# Altium schematic sheet RP_ComputeModule3_rev.3.0_POWER.SchDoc
size A4 portrait
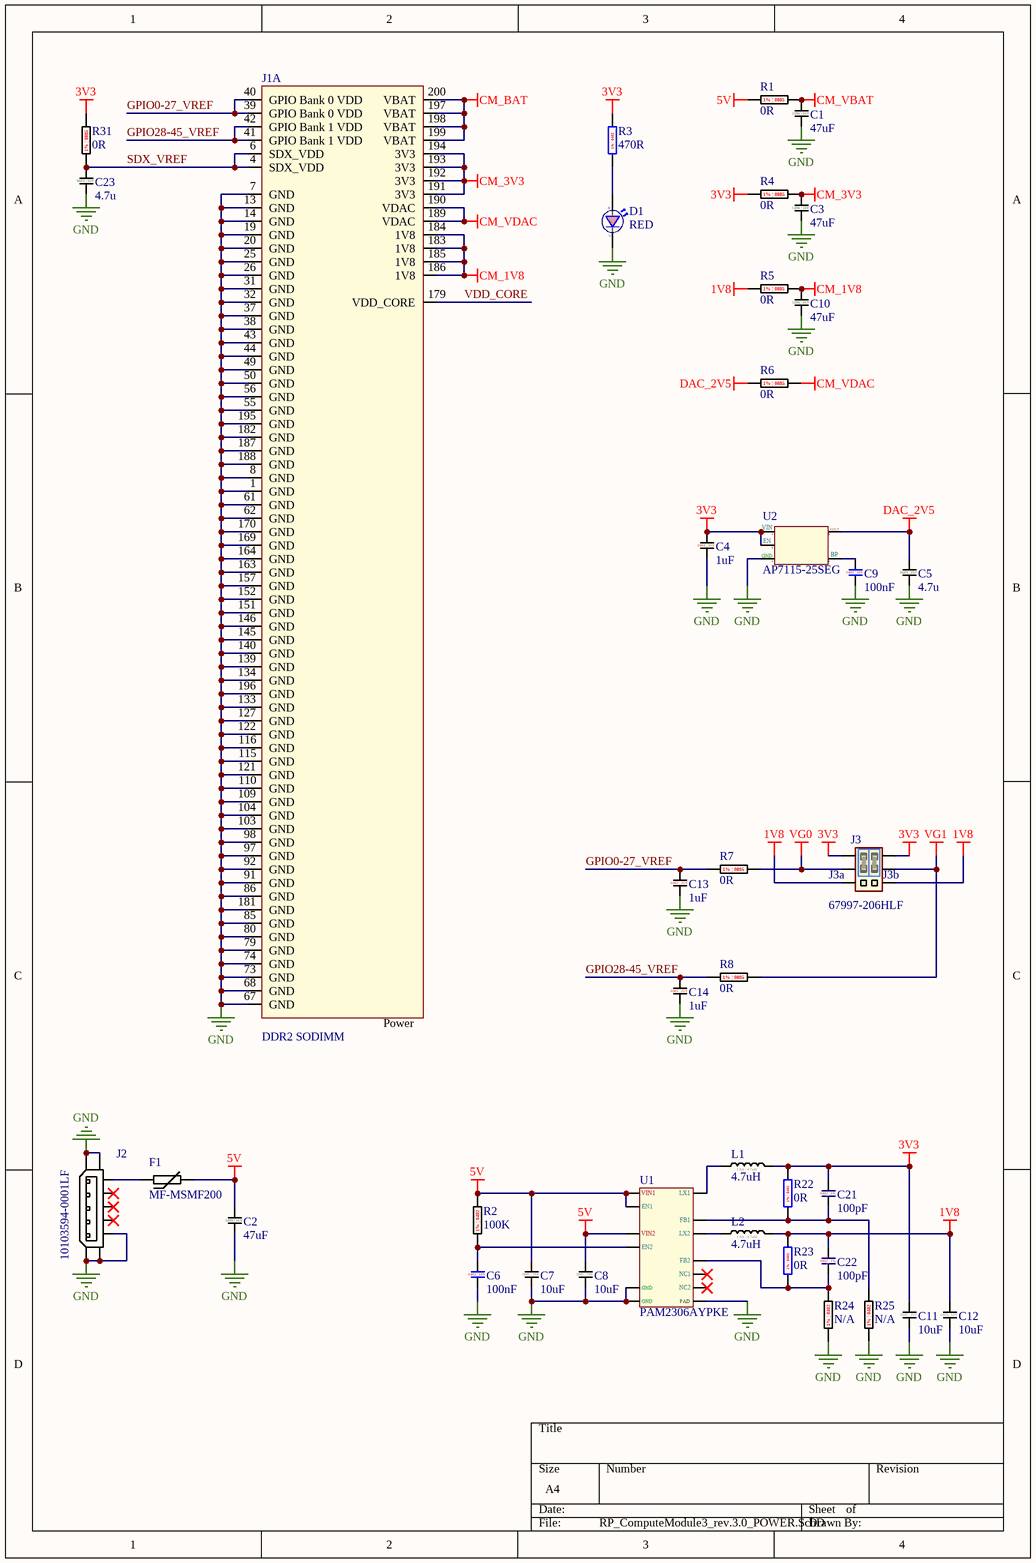
[diagram p0: RP_ComputeModule3_rev.3.0_POWER.SchDoc]

## Parts
C1  47uF  [MURATA C1206 / CAPC3216X94N]
C2  47uF  [MURATA C1206 / CAPC3216X94N]
C3  47uF  [MURATA C1206 / CAPC3216X94N]
C4  1uF  [TDK 0402 C]
C5  4.7u  [0603 Murata]
C6  100nF  [GJM 0402 C]
C7  10uF  [0805 CGA Series]
C8  10uF  [0805 CGA Series]
C9  100nF  [GJM 0402 C]
C10  47uF  [MURATA C1206 / CAPC3216X94N]
C11  10uF  [0805 CGA Series]
C12  10uF  [0805 CGA Series]
C13  1uF  [TDK 0402 C]
C14  1uF  [TDK 0402 C]
C21  100pF  [Cap0402 MIN Vishay N/A]  (no BOM)
C22  100pF  [Cap0402 MIN Vishay N/A]  (no BOM)
C23  4.7u  [0603 Murata]
D1  RED  [ROHM 0603 LED]
F1  MF-MSMF200  [Bourns MF-MSMF (Style1)]
J1  DDR2 SODIMM  [TE 1473005-4 (DDR2 SO-DIMM)]  (part A of 14)
J2  10103594-0001LF  [FCI_10103594-0001LF]
J3  67997-206HLF  [Amphenol 2x6 PINS 67997-206HLF]
J3a  Jumper  [Kobiconn 151-8011-E (Blue)]  (value not drawn)
J3b  Jumper  [Kobiconn 151-8011-E (Blue)]  (value not drawn)
L1  4.7uH  [Bourns SRN4018]
L2  4.7uH  [Bourns SRN4018]
R1  0R  [YAGEO RES0402]
R2  100K  [RES0402]
R3  470R  [Vishay RES0402]
R4  0R  [YAGEO RES0402]
R5  0R  [YAGEO RES0402]
R6  0R  [YAGEO RES0402]
R7  0R  [YAGEO RES0402]
R8  0R  [YAGEO RES0402]
R22  0R  [Vishay Beyschlag MCS0402]
R23  0R  [Vishay Beyschlag MCS0402]
R24  N/A  [RES0402N/A]  (no BOM)
R25  N/A  [RES0402N/A]  (no BOM)
R31  0R  [YAGEO RES0402]
U1  PAM2306AYPKE  [DIODES_SON45P300X300X80-13N]
U2  AP7115-25SEG  [Diodes_SOT353_SC70-5_SOT65P210X110-5N]

## Nets
1V8: C12.1 C22.2 J3.5 J3.6 L2.2 R5.2 R23.1
3V3: C4.1 C11.1 C21.2 J3.1 J3.2 L1.2 R3.1 R4.2 R22.1 R31.1 U2.1 U2.3
5V: C2.2 C7.1 C8.1 F1.2 R1.2 R2.1 U1.1 U1.6 U1.7
CM_1V8: C10.2 J1.183(1V8) J1.184(1V8) J1.185(1V8) J1.186(1V8) R5.1
CM_3V3: C3.2 J1.191(3V3) J1.192(3V3) J1.193(3V3) J1.194(3V3) R4.1
CM_BAT: J1.197(VBAT) J1.198(VBAT) J1.199(VBAT) J1.200(VBAT)
CM_VBAT: C1.2 R1.1
CM_VDAC: J1.189(VDAC) J1.190(VDAC) R6.1
DAC_2V5: C5.2 R6.2 U2.5
GND: C1.1 C2.1 C3.1 C4.2 C5.1 C6.1 C7.2 C8.2 C9.1 C10.1 C11.2 C12.2 C13.2 C14.2 C23.1 D1.C J1.1(GND) J1.7(GND) J1.8(GND) J1.13(GND) J1.14(GND) J1.19(GND) J1.20(GND) J1.25(GND) J1.26(GND) J1.31(GND) J1.32(GND) J1.37(GND) J1.38(GND) J1.43(GND) J1.44(GND) J1.49(GND) J1.50(GND) J1.55(GND) J1.56(GND) J1.61(GND) J1.62(GND) J1.67(GND) J1.68(GND) J1.73(GND) J1.74(GND) J1.79(GND) J1.80(GND) J1.85(GND) J1.86(GND) J1.91(GND) J1.92(GND) J1.97(GND) J1.98(GND) J1.103(GND) J1.104(GND) J1.109(GND) J1.110(GND) J1.115(GND) J1.116(GND) J1.121(GND) J1.122(GND) J1.127(GND) J1.133(GND) J1.134(GND) J1.139(GND) J1.140(GND) J1.145(GND) J1.146(GND) J1.151(GND) J1.152(GND) J1.157(GND) J1.163(GND) J1.164(GND) J1.169(GND) J1.170(GND) J1.181(GND) J1.182(GND) J1.187(GND) J1.188(GND) J1.195(GND) J1.196(GND) J2.5 J2.6 J2.7 J2.8 J2.9 J2.10 J2.11 R24.2 R25.2 U1.3 U1.9 U1.13 U2.2
VG0: J3.3 R7.1
VG1: J3.4 R8.1
GPIO0-27_VREF: C13.1 J1.39(GPIO_Bank_0_VDD) J1.40(GPIO_Bank_0_VDD) R7.2
GPIO28-45_VREF: C14.1 J1.41(GPIO_Bank_1_VDD) J1.42(GPIO_Bank_1_VDD) R8.2
SDX_VREF: C23.2 J1.4(SDX_VDD) J1.6(SDX_VDD) R31.2
VDD_CORE: J1.179(VDD_CORE)
NetC6_2: C6.2 R2.2 U1.12
NetC9_2: C9.2 U2.4
NetC21_1: C21.1 R22.2 R25.1 U1.4
NetC22_1: C22.1 R23.2 R24.1 U1.10
NetD1_A: D1.A R3.2
NetF1_1: F1.1 J2.1
NetL1_1: L1.1 U1.8
NetL2_1: L2.1 U1.2

Not connected (* = marked no-connect by the designer): J2 2* 3* 4*; U1 5* 11*

## Notes on the sheet
- (in symbol AC0805FR-070RL) 1% | 0805
- (in symbol AP7115-25SEG-7) VIN; VOUT; EN; BP; GND
- (in symbol C1005X5R1E105K050BC) 0402 | 25V
- (in symbol C2012X7S1C106K125AC) 0805 | 16V
- (in symbol C3216JB1C476M160AB) 1206 | 16V
- (in symbol GRM155R71A104JA01D) 0402 | 10V
- (in symbol GRT188R6YA475KE13D) 0603 | 35V
- (in symbol MCS04020C4700FE000) 1% | 0402
- (in symbol MCS04020Z0000ZE000) 1% | 0402
- (in symbol PAM2306AYPKE) VIN1; LX1; EN1; FB1; VIN2; LX2; EN2; FB2; NC1; GND; NC2; PAD
- (in symbol Resistor_N/A) 1% | 0402
- (in symbol SG73P1ETTP1003F) 1% | 0402
- (in symbol SRN4018-4R7M) 1.9A / 4.7uH
- (in symbol VJ0402A101FXACW1BC_NA) 0402 | 1%

## Library data of the parts
C1-C3 C10 = C3216JB1C476M160AB: 47µF ±20% 16V JB Ceramic Capacitor -25°C ~ 85°C Surface Mount, MLCC 1206 (3216 Metric) 0.126" L x 0.063" W (3.20mm x 1.60mm); Manufacturer: TDK; Supplier 1: Digi-Key; Manufacturer Part Number: C3216JB1C476M160AB; Stock 1: 203837; Pricing 1: 1=1.2, 10=0.949, 100=0.7116, 500=0.53762, 1000=0.47438 (USD); Mount: Surface Mount; Case/Package: 1206; Case Code (Metric): 3216; Case Code (Imperial): 1206; Dielectric Material: Ceramic; Min Operating Temperature: -25°C; Max Operating Temperature: 85°C; Package Quantity: 1; Packaging: Tape and Reel; Capacitance: 47uF; Tolerance: 20%; Voltage Rating: 16V; Termination: SMD/SMT; Composition: Ceramic; Voltage Rating (DC): 16V; Length: 0.126inch; Height: 1.6mm; Width: 0.063inch; Thickness: 0.069inch; Lead Free: Lead Free; ComponentLink1URL: https://product.tdk.com/en/products/common/pdf/mlcc_partnumber_description.pdf; ComponentLink1Description: https://product.tdk.com/en/products/common/pdf/mlcc_partnumber_description.pdf; ComponentLink2URL: http://product.tdk.com/en/catalog/datasheets/mlcc_commercial_general_en.pdf; ComponentLink2Description: http://product.tdk.com/en/catalog/datasheets/mlcc_commercial_general_en.pdf; ComponentLink3URL: http://www.mouser.com/ds/2/400/lcc_commercial_general_en-837201.pdf; ComponentLink3Description: http://www.mouser.com/ds/2/400/lcc_commercial_general_en-837201.pdf
C4 C13 C14 = C1005X5R1E105K050BC: Multilayer Ceramic Capacitors MLCC - SMD/SMT 0402 25V 1uF X5R 10% T: 0.5mm; Manufacturer: TDK; Type: Multilayer Ceramic Chip Capacitor; Voltage Rating DC: 25 VDC; Capacitance - nF: 1000 nF; Product Status: Not Recommended for New Designs; Supplier 1: Mouser; Manufacturer Part Number: C1005X5R1E105K050BC; RoHS: RoHS Compliant; Category: Multilayer Ceramic Capacitors MLCC - SMD/SMT; Stock 1: 6906; Pricing 1: 1=0.201, 10=0.136, 100=0.054, 500=0.045, 1000=0.037, 2500=0.031, 10000=0.027 (USD); Capacitance: 1 uF; Height: 0.5 mm; Length: 1 mm; Package / Case: 0402 (1005 metric); Packaging: Cut Tape; Product: General Type MLCCs; Series: C; Termination Style: SMD/SMT; Tolerance: 10 %; Width: 0.5 mm; Brand: TDK; Case Code - in: 0402; Case Code - mm: 1005; Dielectric: X5R; Maximum Operating Temperature: + 85 C; Minimum Operating Temperature: - 55 C; Standard Pack Qty: 10000; RoHS - Mouser: Y; Minimum Order Quantity: 1; Reeling: True; ComponentLink1URL: https://www.mouser.com/ds/2/400/lcc_commercial_general_en-837201.pdf; ComponentLink1Description: https://www.mouser.com/ds/2/400/lcc_commercial_general_en-837201.pdf
C5 C23 = GRT188R6YA475KE13D: 4.7µF 35V Ceramic Capacitor X5R 0603 (1608 Metric) 0.063" L x 0.031" W (1.60mm x 0.80mm); Manufacturer: Murata; Capacitance: 4.7uF; Tolerance: 10%; Supplier 1: Mouser; Manufacturer Part Number: GRT188R6YA475KE13D; Stock 1: 292; Pricing 1: 10000=0.133 (USD); Mount: Surface Mount; Case/Package: 0603; Case Code (Metric): 1608; Case Code (Imperial): 0603; Min Operating Temperature: -55°C; Max Operating Temperature: 85°C; Packaging: Tape and Reel; Voltage Rating: 35V; Length: 0.063inch; Width: 0.031inch; Thickness: 0.035inch; ComponentLink1URL: http://search.murata.co.jp/Ceramy/image/img/A01X/G101/ENG/GRT188R6YA475KE13-01.pdf; ComponentLink1Description: http://search.murata.co.jp/Ceramy/image/img/A01X/G101/ENG/GRT188R6YA475KE13-01.pdf
C6 C9 = GRM155R71A104JA01D: Multilayer Ceramic Capacitors MLCC - SMD/SMT 0402 0.1uF 10volts 5%; Manufacturer: Murata Electronics; Type: Chip Monolithic Ceramic Capacitor; Voltage Rating DC: 10 VDC; Capacitance - pF: 100000 pF; Dielectric: X7R; Supplier 1: Mouser; Manufacturer Part Number: GRM155R71A104JA01D; RoHS: RoHS Compliant; Category: Multilayer Ceramic Capacitors MLCC - SMD/SMT; Stock 1: 376; Pricing 1: 1=0.100, 10=0.024, 100=0.011, 500=0.008, 1000=0.006, 5000=0.005, 10000=0.004 (USD); Capacitance: 0.1 uF; Height: 0.5 mm; Length: 1 mm; Package / Case: 0402 (1005 metric); Packaging: Cut Tape; Product: General Type MLCCs; Series: GRM; Termination Style: SMD/SMT; Tolerance: 5 %; Width: 0.5 mm; Brand: Murata Electronics; Capacitance - nF: 100 nF; Case Code - in: 0402; Case Code - mm: 1005; Maximum Operating Temperature: + 125 C; Minimum Operating Temperature: - 55 C; Standard Pack Qty: 10000; RoHS - Mouser: Y; Minimum Order Quantity: 1; Reeling: True; ComponentLink1URL: https://www.mouser.com/ds/2/281/c02e-2905.pdf; ComponentLink1Description: https://www.mouser.com/ds/2/281/c02e-2905.pdf
C7 C8 C11 C12 = C2012X7S1C106K125AC: Manufacturer: TDK; Supplier 1: Mouser; Manufacturer Part Number: C2012X7S1C106K125AC; Stock 1: 5410; Pricing 1: 1=0.7, 10=0.4, 50=0.4, 100=0.27, 1000=0.226, 10000=0.138 (USD)
C21 C22 = VJ0402A101FXACW1BC_NA: Multilayer Ceramic Capacitors MLCC - SMD/SMT 0402 100pF 50volts C0G 1%; Manufacturer: Vishay Vitramon; Dielectric Material: Tantalum; Voltage Rating (DC): 50V; Supplier 1: Mouser; Manufacturer Part Number: VJ0402A101FXACW1BC; Stock 1: 4478; Pricing 1: 10000=0.026 (USD); Mount: Surface Mount; Case/Package: 0402; Case Code (Imperial): 0402; Case Code (Metric): 1005; Min Operating Temperature: -55°C; Max Operating Temperature: 125°C; Capacitance: 100pF; Tolerance: 1%; Packaging: Tape and Reel; Package Quantity: 10000; Dielectric: C0G; Termination: SMD/SMT; Length: 1mm; Height: 0.55mm; Width: 0.5mm; Depth: 0.5mm; Lead Free: Lead Free; ComponentLink1URL: https://datasheet.ciiva.com/11477/vjw1bcbascomseries-11477228.pdf; ComponentLink1Description: https://datasheet.ciiva.com/11477/vjw1bcbascomseries-11477228.pdf
D1 = SML-D12U8WT86: LED RED DIFFUSED 0603 SMD; Manufacturer: Rohm; Lens Colour: White,Clear,Diffused; Lens Style: Diffused,Colorless,Rectangular; Forward Voltage: 2.2V; Forward Current: 20mA; Luminous Intensity: 63mcd; Dominant Wavelength: 620nm; Number of LEDs: 1; Viewing Angle: 160°; Supplier 1: Mouser; Manufacturer Part Number: SML-D12U8WT86; Stock 1: 16573; Pricing 1: 1=0.32, 10=0.216, 50=0.216, 100=0.09, 1000=0.062, 10000=0.041 (USD); Mount: Surface Mount; Case/Package: 0603; Number of Pins: 2; Colour: Red; Case Code (Metric): 1608; Case Code (Imperial): 0603; Min Operating Temperature: -40°C; Max Operating Temperature: 85°C; Packaging: Tape and Reel; Wavelength: 620nm; Package Quantity: 1; Illumination Colour: Red; Test Current: 20mA; Lens Transparency: Diffused; Length: 1.6mm; Height: 0.65mm; Width: 0.8mm; Radiation Hardening: No; REACH SVHC: No SVHC; Lead Free: Lead Free; ComponentLink1URL: https://datasheet.ciiva.com/11774/0900766b80df3ada-11774020.pdf; ComponentLink1Description: https://datasheet.ciiva.com/11774/0900766b80df3ada-11774020.pdf; ComponentLink2URL: https://datasheet.ciiva.com/2110/sml-d1-2110375.pdf; ComponentLink2Description: https://datasheet.ciiva.com/2110/sml-d1-2110375.pdf; ComponentLink3URL: https://datasheet.ciiva.com/2110/sml-d1-2110376.pdf; ComponentLink3Description: https://datasheet.ciiva.com/2110/sml-d1-2110376.pdf; ComponentLink4URL: https://datasheet.ciiva.com/2110/sml-d1-2110377.pdf; ComponentLink4Description: https://datasheet.ciiva.com/2110/sml-d1-2110377.pdf; ComponentLink5URL: https://datasheet.ciiva.com/9324/sml-d1-9324826.pdf; ComponentLink5Description: https://datasheet.ciiva.com/9324/sml-d1-9324826.pdf; ComponentLink6URL: https://datasheet.ciiva.com/17420/sml-d1-17420939.pdf; ComponentLink6Description: https://datasheet.ciiva.com/17420/sml-d1-17420939.pdf
F1 = MF-MSMF200-2: PTC RESETTABLE 2.00A 8V 1812; Manufacturer: Bourns; Max Current Rating: 40A; Power Dissipation: 800mW; Hold Current: 2A; Trip Current: 4A; Resistance: 80mR; Time to Trip: 3s; Approvals: UL,CSA,TUV; Supplier 1: Mouser; Manufacturer Part Number: MF-MSMF200-2; Stock 1: 5483; Pricing 1: 1=0.38, 10=0.306, 50=0.306, 100=0.255, 1000=0.244, 10000=0.244 (USD); Mount: Surface Mount,PCB; Case/Package: 1812; Case Code (Metric): 4532; Case Code (Imperial): 1812; Number of Terminals: 2; Terminal Material: Nickel; Min Operating Temperature: -40°C; Max Operating Temperature: 85°C; Current Rating: 40A; Package Quantity: 2000; Packaging: Tape and Reel; Operating Supply Voltage: 8V; Voltage Rating: 8V; Termination: SMD/SMT; Max Power Dissipation: 800mW; Voltage Rating (DC): 8V; Length: 4.73mm; Height: 0.85mm; Width: 3.41mm; Radiation Hardening: No; REACH SVHC: No SVHC; Lead Free: Lead Free; ComponentLink1URL: https://datasheet.ciiva.com/1228/1786007-1228163.pdf; ComponentLink1Description: https://datasheet.ciiva.com/1228/1786007-1228163.pdf; ComponentLink2URL: https://datasheet.ciiva.com/3020/mfmsmf-3020419.pdf; ComponentLink2Description: https://datasheet.ciiva.com/3020/mfmsmf-3020419.pdf; ComponentLink3URL: https://datasheet.ciiva.com/326/mfmsmf-326966.pdf; ComponentLink3Description: https://datasheet.ciiva.com/326/mfmsmf-326966.pdf; ComponentLink4URL: https://datasheet.ciiva.com/326/mfmsmf-326967.pdf; ComponentLink4Description: https://datasheet.ciiva.com/326/mfmsmf-326967.pdf; ComponentLink5URL: https://datasheet.ciiva.com/326/mfmsmf-326968.pdf; ComponentLink5Description: https://datasheet.ciiva.com/326/mfmsmf-326968.pdf; ComponentLink6URL: https://datasheet.ciiva.com/16692/mfmsmf-16692201.pdf; ComponentLink6Description: https://datasheet.ciiva.com/16692/mfmsmf-16692201.pdf; ComponentLink7URL: https://datasheet.ciiva.com/3019/mfmsmf-3019786.pdf; ComponentLink7Description: https://datasheet.ciiva.com/3019/mfmsmf-3019786.pdf; ComponentLink8URL: https://datasheet.ciiva.com/28411/1786007-28411578.pdf; ComponentLink8Description: https://datasheet.ciiva.com/28411/1786007-28411578.pdf; ComponentLink9URL: https://datasheet.ciiva.com/1274/1786007-1274556.pdf; ComponentLink9Description: https://datasheet.ciiva.com/1274/1786007-1274556.pdf; ComponentLink10URL: https://datasheet.ciiva.com/15187/getdatasheetpartid-117210-15187148.pdf; ComponentLink10Description: https://datasheet.ciiva.com/15187/getdatasheetpartid-117210-15187148.pdf; ComponentLink11URL: https://datasheet.ciiva.com/1274/1786007-1274557.pdf; ComponentLink11Description: https://datasheet.ciiva.com/1274/1786007-1274557.pdf; ComponentLink12URL: https://datasheet.ciiva.com/30196/575mfmsmf-30196429.pdf; ComponentLink12Description: https://datasheet.ciiva.com/30196/575mfmsmf-30196429.pdf
J1 = 1473005-4: TE CONNECTIVITY / AMP         1473005-4             SOCKET IC, DIMM, DDR2, 1.8V, 200WAY; Number of Contacts: 200; Memory Type: SDRAM,DDR; Insulation Resistance: 250MR; PCB Mount Retention: With; Gender: Female; Contact Current Rating: 500mA; Circuit Application: Power; Connector System: Cable-to-Board; Sealable: No (Without); Pitch: 0.6mm; Row Spacing: 0.244inch; Stack Height: 5.2mm; Supplier 1: Digi-Key; Manufacturer: TE Connectivity; Manufacturer Part Number: 1473005-4; Stock 1: 3804; Pricing 1: 1=3.9, 10=3.744, 25=3.432, 50=3.276, 100=3.12, 250=2.73, 500=2.652, 1000=2.262, 2500=2.106 (USD); Mount: Surface Mount; Number of Pins: 200; Contact Material: Copper Alloy; Contact Plating: Gold; Housing Colour: Black; Housing Material: Thermoplastic; Insulation Material: Thermoplastic; Min Operating Temperature: -67°C; Max Operating Temperature: 185°C; Number of Rows: 2; Orientation: Right Angle; Termination: Solder; Packaging: Tray; Package Quantity: 20; Number of Positions: 200; Voltage Rating: 1.8V; Connector Type: Socket; Length: 71.5mm; Depth: 26mm; Radiation Hardening: No; ELV: Compliant; Flammability Rating: UL94 V-0; Lead Free: Lead Free; REACH SVHC: No SVHC; ComponentLink1URL: https://datasheet.ciiva.com/682/eng-cd-1473005-j2-682720.pdf; ComponentLink1Description: https://datasheet.ciiva.com/682/eng-cd-1473005-j2-682720.pdf; ComponentLink2URL: https://datasheet.ciiva.com/15171/getdatasheetpartid-99150-15171488.pdf; ComponentLink2Description: https://datasheet.ciiva.com/15171/getdatasheetpartid-99150-15171488.pdf; ComponentLink3URL: https://datasheet.ciiva.com/1105/582309-1105221.pdf; ComponentLink3Description: https://datasheet.ciiva.com/1105/582309-1105221.pdf; ComponentLink4URL: https://datasheet.ciiva.com/682/eng-cd-1473005-j2-682726.pdf; ComponentLink4Description: https://datasheet.ciiva.com/682/eng-cd-1473005-j2-682726.pdf; ComponentLink5URL: https://datasheet.ciiva.com/14156/04821302-14156311.pdf; ComponentLink5Description: https://datasheet.ciiva.com/14156/04821302-14156311.pdf; ComponentLink6URL: https://datasheet.ciiva.com/3136/eng-cd-1473005-j-3136060.pdf; ComponentLink6Description: https://datasheet.ciiva.com/3136/eng-cd-1473005-j-3136060.pdf; ComponentLink7URL: https://datasheet.ciiva.com/16380/eng-cd-1473005-j-16380909.pdf; ComponentLink7Description: https://datasheet.ciiva.com/16380/eng-cd-1473005-j-16380909.pdf; ComponentLink8URL: https://datasheet.ciiva.com/16651/eng-cd-1473005-j-16651646.pdf; ComponentLink8Description: https://datasheet.ciiva.com/16651/eng-cd-1473005-j-16651646.pdf
J2 = 10103594-0001LF: USB - micro B USB 2.0 Receptacle Connector 5 Position Surface Mount, Right Angle, Horizontal; Manufacturer: Amphenol FCI; Voltage Rating: 100V; Current Rating: 1.8A; Connector Type: USB,Receptacle; Number of Ports: 1; Insulation Resistance: 1GR; Number of Contacts: 5; USB Standard: USB 2.0; Pitch: 0.65mm; Supplier 1: Mouser; Manufacturer Part Number: 10103594-0001LF; Stock 1: 28662; Pricing 1: 1=0.7, 10=0.522, 50=0.522, 100=0.501, 1000=0.359, 10000=0.294 (USD); Mount: Surface Mount,Horizontal; Contact Plating: Nickel,Gold; Contact Material: Copper,Copper Alloy; Number of Terminals: 5; Housing Material: Thermoplastic; Min Operating Temperature: -55°C; Max Operating Temperature: 85°C; Termination: Solder; Orientation: Right Angle; Gender: Receptacle; Packaging: Tape and Reel; Package Quantity: 1500; Max Voltage Rating (AC): 100V; Length: 8.04mm; Radiation Hardening: No; REACH SVHC: No SVHC; Lead Free: Lead Free; ComponentLink1URL: https://datasheet.ciiva.com/8015/10103594-8015248.pdf; ComponentLink1Description: https://datasheet.ciiva.com/8015/10103594-8015248.pdf; ComponentLink2URL: https://datasheet.ciiva.com/11731/0900766b80ed1ae4-11731328.pdf; ComponentLink2Description: https://datasheet.ciiva.com/11731/0900766b80ed1ae4-11731328.pdf; ComponentLink3URL: https://datasheet.ciiva.com/14618/70236822-14618885.pdf; ComponentLink3Description: https://datasheet.ciiva.com/14618/70236822-14618885.pdf; ComponentLink4URL: https://datasheet.ciiva.com/22654/1469075-22654519.pdf; ComponentLink4Description: https://datasheet.ciiva.com/22654/1469075-22654519.pdf; ComponentLink5URL: https://datasheet.ciiva.com/851/10103594-851115.pdf; ComponentLink5Description: https://datasheet.ciiva.com/851/10103594-851115.pdf; ComponentLink6URL: https://datasheet.ciiva.com/5726/10103594-5726971.pdf; ComponentLink6Description: https://datasheet.ciiva.com/5726/10103594-5726971.pdf; ComponentLink7URL: https://datasheet.ciiva.com/851/10103594-851116.pdf; ComponentLink7Description: https://datasheet.ciiva.com/851/10103594-851116.pdf; ComponentLink8URL: https://datasheet.ciiva.com/851/10103594-851117.pdf; ComponentLink8Description: https://datasheet.ciiva.com/851/10103594-851117.pdf
J3 = 67997-206HLF: 6 Positions Header, Unshrouded Connector 0.100" (2.54mm) Through Hole Gold or Gold, GXT™; Manufacturer: Amphenol FCI; Current Rating: 3A; Voltage Rating: 1.5kV; Number of Positions: 6; Insulation Resistance: 5GR; Gender: Male; Connector Type: Male Pin; Mating Post Length: 5.84mm; Row Spacing: 0.1inch; Supplier 1: Mouser; Manufacturer Part Number: 67997-206HLF; Stock 1: 2377; Pricing 1: 1=0.33, 10=0.223, 50=0.223, 100=0.215, 1000=0.154, 10000=0.123 (USD); Mount: Through Hole; Contact Plating: Nickel,Gold,GXT; Contact Material: Bronze; Colour: Black; Housing Colour: Black; Housing Material: Thermoplastic; Min Operating Temperature: -65°C; Max Operating Temperature: 125°C; Number of Rows: 2; Contact Gender: Male; Packaging: Bulk; Package Quantity: 100; Termination: Solder; Max Voltage Rating (AC): 1.5kV; Number of Contacts: 6; Orientation: Straight; Length: 7.62mm; Pitch: 2.54mm; Termination Post Length: 3.05mm; Contact Mating Length: 0.23inch; Depth: 4.83mm; Radiation Hardening: No; Flammability Rating: UL94 V-0; ComponentLink1URL: https://datasheet.ciiva.com/5150/67996-223474-5150000.pdf; ComponentLink1Description: https://datasheet.ciiva.com/5150/67996-223474-5150000.pdf; ComponentLink2URL: https://datasheet.ciiva.com/9474/67996-9474266.pdf; ComponentLink2Description: https://datasheet.ciiva.com/9474/67996-9474266.pdf; ComponentLink3URL: https://datasheet.ciiva.com/728/67996-728908.pdf; ComponentLink3Description: https://datasheet.ciiva.com/728/67996-728908.pdf
J3a J3b = 151-8011-E: Headers & Wire Housings MINI JUMPER GF 6.0MM CLOSE TYPE BLUE; Manufacturer: Kobiconn; Number of Positions: 2; Pitch: 2.54mm; Supplier 1: Mouser; Manufacturer Part Number: 151-8011-E; Stock 1: 0; Contact Gender: Male; Package Quantity: 2000; ComponentLink1URL: https://datasheet.ciiva.com/5162/kc-301174-5162989.pdf; ComponentLink1Description: https://datasheet.ciiva.com/5162/kc-301174-5162989.pdf
L1 L2 = SRN4018-4R7M: FIXED IND 4.7UH 1.9A 84 MOHM SMD; Manufacturer: Bourns; Core Material: Ferrite; Material: Steel; Saturation Current: 2A; Tolerance: 20%; Shielding: Shielded; DC Resistance (DCR): 84mR; Self Resonant Frequency: 35MHz; Test Frequency: 100kHz; Supplier 1: Mouser; Manufacturer Part Number: SRN4018-4R7M; Stock 1: 1984; Pricing 1: 1=0.36, 10=0.246, 50=0.246, 100=0.224, 1000=0.152, 10000=0.131 (USD); Mount: Surface Mount; Case/Package: Nonstandard; Number of Pins: 2; Min Operating Temperature: -25°C; Max Operating Temperature: 120°C; Packaging: Cut Tape; Package Quantity: 3000; Current Rating: 1.9A; Inductance: 4.7uh; Inductance Tolerance: 20%; Composition: Wirewound; Max DC Current: 1.9A; Termination: SMD/SMT; RMS Current (Irms): 1.9A; DC Current: 1.9A; Military Standard: Not; Length: 4mm; Height: 1.8mm; Width: 4mm; Height - Seated (Max): 0.071inch; Depth: 4.2mm; Radiation Hardening: No; REACH SVHC: No SVHC; ComponentLink1URL: https://datasheet.ciiva.com/6700/srn4018-6700960.pdf; ComponentLink1Description: https://datasheet.ciiva.com/6700/srn4018-6700960.pdf; ComponentLink2URL: https://datasheet.ciiva.com/22717/1684089-22717774.pdf; ComponentLink2Description: https://datasheet.ciiva.com/22717/1684089-22717774.pdf; ComponentLink3URL: https://datasheet.ciiva.com/46395/1684089-46395167.pdf; ComponentLink3Description: https://datasheet.ciiva.com/46395/1684089-46395167.pdf
R1 R4-R8 R31 = AC0805FR-070RL: Thick Film Resistors - SMD 1/8W 0.0ohm 1%; Manufacturer: Yageo; Voltage Rating: 150V; Power Rating: 125mW; Resistance: 0mR; Temperature Coefficient: 200ppm/°C; Supplier 1: Mouser; Manufacturer Part Number: AC0805FR-070RL; Stock 1: 1027; Pricing 1: 1=0.16, 10=0.036, 50=0.036, 100=0.012, 1000=0.009, 10000=0.004 (USD); Mount: Surface Mount; Case/Package: 0805; Case Code (Imperial): 0805; Case Code (Metric): 2012; Min Operating Temperature: -55°C; Max Operating Temperature: 155°C; Tolerance: 1%; Packaging: Tape and Reel; Termination: SMD/SMT; Lead Free: Lead Free; ComponentLink1URL: https://datasheet.ciiva.com/12656/pyu-ac-51-rohs-l-2-12656890.pdf; ComponentLink1Description: https://datasheet.ciiva.com/12656/pyu-ac-51-rohs-l-2-12656890.pdf
R2 = SG73P1ETTP1003F: Thick Film Resistors - SMD 0.125W 100Kohm 1% 200ppm; Manufacturer: KOA Speer; Resistance: 100kR; Power Rating: 125mW; Voltage Rating: 200V; Temperature Coefficient: 200ppm/°C; Voltage Rating (DC): 50V; Supplier 1: Mouser; Manufacturer Part Number: SG73P1ETTP1003F; Stock 1: 17094; Pricing 1: 1=0.24, 10=0.24, 50=0.053, 100=0.041, 1000=0.03, 10000=0.018 (USD); Case/Package: 0402; Case Code (Imperial): 0402; Case Code (Metric): 1005; Min Operating Temperature: -55°C; Max Operating Temperature: 155°C; Tolerance: 1%; Packaging: Tape and Reel; Termination: SMD/SMT; ComponentLink1URL: https://datasheet.ciiva.com/5567/sg73-5567782.pdf; ComponentLink1Description: https://datasheet.ciiva.com/5567/sg73-5567782.pdf
R3 = MCS04020C4700FE000: RES SMD 470 OHM 1% 1/10W 0402; Manufacturer: Vishay BCcomponents; Temperature Coefficient: 50ppm/°C; Max Power Dissipation: 100mW; Supplier 1: Digi-Key; Manufacturer Part Number: MCS04020C4700FE000; Stock 1: 98990; Pricing 1: 1=0.3, 10=0.254, 100=0.0993, 1000=0.04158, 2500=0.03812, 5000=0.03465 (USD); Case/Package: 0402; Contact Plating: Tin; Min Operating Temperature: -55°C; Max Operating Temperature: 125°C; Resistance: 470R; Tolerance: 1%; Composition: Thin Film; Packaging: Tape and Reel; Package Quantity: 10000; Number of Terminations: 2; Military Standard: Not; Length: 0.039inch; Height: 0.015inch; Width: 0.02inch; Depth: 0.5mm; Radiation Hardening: No; Lead Free: Lead Free; ComponentLink1URL: https://datasheet.ciiva.com/16892/mc-pro-16892843.pdf; ComponentLink1Description: https://datasheet.ciiva.com/16892/mc-pro-16892843.pdf; ComponentLink2URL: https://datasheet.ciiva.com/2569/mc-pro-2569740.pdf; ComponentLink2Description: https://datasheet.ciiva.com/2569/mc-pro-2569740.pdf; ComponentLink3URL: https://datasheet.ciiva.com/8901/mc-pro-8901326.pdf; ComponentLink3Description: https://datasheet.ciiva.com/8901/mc-pro-8901326.pdf
R22 R23 = MCS04020Z0000ZE000: Res Thin Film 0402 0 Ohm Molded SMD Automotive Medical Paper T/R; Manufacturer: Vishay Beyschlag; Resistance: 0mR; Power Rating: 100mW; Voltage Rating: 50V; Supplier 1: Digi-Key; Manufacturer Part Number: MCS04020Z0000ZE000; Stock 1: 192140; Pricing 1: 1=0.31, 10=0.266, 25=0.1936, 50=0.1404, 100=0.1041, 250=0.07988, 500=0.06292, 1000=0.04356, 5000=0.0363 (USD); Mount: Surface Mount; Case/Package: 0402; Contact Plating: Nickel,Tin; Case Code (Metric): 1005; Case Code (Imperial): 0402; Min Operating Temperature: -55°C; Max Operating Temperature: 125°C; Composition: Thin Film; Package Quantity: 1; Packaging: Tape and Reel; Number of Terminations: 2; Military Standard: Not; Max Power Dissipation: 100mW; Voltage Rating (DC): 50V; Termination: Wraparound; Length: 1mm; Height: 0.015inch; Width: 0.02inch; Depth: 0.5mm; Radiation Hardening: No; REACH SVHC: No SVHC; Lead Free: Lead Free; ComponentLink1URL: https://datasheet.ciiva.com/2472/mc-pro-2472006.pdf; ComponentLink1Description: https://datasheet.ciiva.com/2472/mc-pro-2472006.pdf; ComponentLink2URL: https://datasheet.ciiva.com/8901/mc-pro-8901830.pdf; ComponentLink2Description: https://datasheet.ciiva.com/8901/mc-pro-8901830.pdf; ComponentLink3URL: https://datasheet.ciiva.com/2472/mc-pro-2472007.pdf; ComponentLink3Description: https://datasheet.ciiva.com/2472/mc-pro-2472007.pdf; ComponentLink4URL: https://datasheet.ciiva.com/2472/mc-pro-2472008.pdf; ComponentLink4Description: https://datasheet.ciiva.com/2472/mc-pro-2472008.pdf
R24 R25 = Resistor_N/A
U1 = PAM2306AYPKE: Conv DC-DC Dual Step Down 2.5V 5.5V 12-Pin WDFN T/R; Manufacturer: Diodes; Number of Outputs: 2; Output Voltage: 3.3V; Max Output Current: 1A; Efficiency: 96%; Switching Frequency: 1.5MHz; Synchronous Rectifier: Yes; Operating Supply Current: 40uA; Supplier 1: Mouser; Manufacturer Part Number: PAM2306AYPKE; Stock 1: 11874; Pricing 1: 1=0.71, 10=0.589, 50=0.589, 100=0.38, 1000=0.304, 10000=0.248 (USD); Mount: Surface Mount; Number of Pins: 12; Min Operating Temperature: -40°C; Max Operating Temperature: 85°C; Packaging: Tape and Reel; Min Input Voltage: 2.5V; Max Input Voltage: 5.5V; Min Output Voltage: 3.3V; Output Current: 1A; Package Quantity: 3000; Min Supply Voltage: 2.5V; Operating Supply Voltage: 5.5V; Radiation Hardening: No; Lead Free: Lead Free; ComponentLink1URL: http://www.diodes.com/datasheets/PAM2306.pdf; ComponentLink1Description: http://www.diodes.com/datasheets/PAM2306.pdf; ComponentLink2URL: http://www.mouser.com/ds/2/115/PAM2306-336770.pdf; ComponentLink2Description: http://www.mouser.com/ds/2/115/PAM2306-336770.pdf; ComponentLink3URL: https://www.diodes.com/assets/Datasheets/PAM2306.pdf; ComponentLink3Description: https://www.diodes.com/assets/Datasheets/PAM2306.pdf
U2 = AP7115-25SEG-7: IC REG LDO 2.5V 0.15A SOT353; Manufacturer: Diodes; Max Power Dissipation: 500mW; Number of Outputs: 1; Max Input Voltage: 5.5V; Max Output Current: 150mA; Quiescent Current: 80uA; Polarity: Positive; Accuracy: 2%; Dropout Voltage: 200mV; Min Current Limit: 200mA; Power Supply Rejection Ratio (PSRR): 70dB; Supplier 1: Mouser; Manufacturer Part Number: AP7115-25SEG-7; Stock 1: 5001; Pricing 1: 1=0.38, 10=0.288, 50=0.288, 100=0.156, 1000=0.117, 10000=0.095 (USD); Mount: Surface Mount; Case/Package: SOT-353-5; Number of Pins: 5; Contact Plating: Tin,Matte; Min Operating Temperature: -40°C; Max Operating Temperature: 85°C; Output Voltage: 2.5V; Packaging: Tape and Reel; Min Input Voltage: 2.5V; Package Quantity: 1; Output Current: 150mA; Number of Regulators: 1; Power Rating: 500mW; Input Bias Current: 80uA; Length: 3mm; Height: 1.1mm; Width: 1.6mm; ComponentLink1URL: https://datasheet.ciiva.com/2039/ap7115-2039392.pdf; ComponentLink1Description: https://datasheet.ciiva.com/2039/ap7115-2039392.pdf; ComponentLink2URL: https://datasheet.ciiva.com/26949/getdatasheetpartid-671041-26949332.pdf; ComponentLink2Description: https://datasheet.ciiva.com/26949/getdatasheetpartid-671041-26949332.pdf; ComponentLink3URL: https://datasheet.ciiva.com/17365/ap7115-17365815.pdf; ComponentLink3Description: https://datasheet.ciiva.com/17365/ap7115-17365815.pdf